# EAGLE design Shruti-FrontPanel-v02 (EAGLE 5.06)
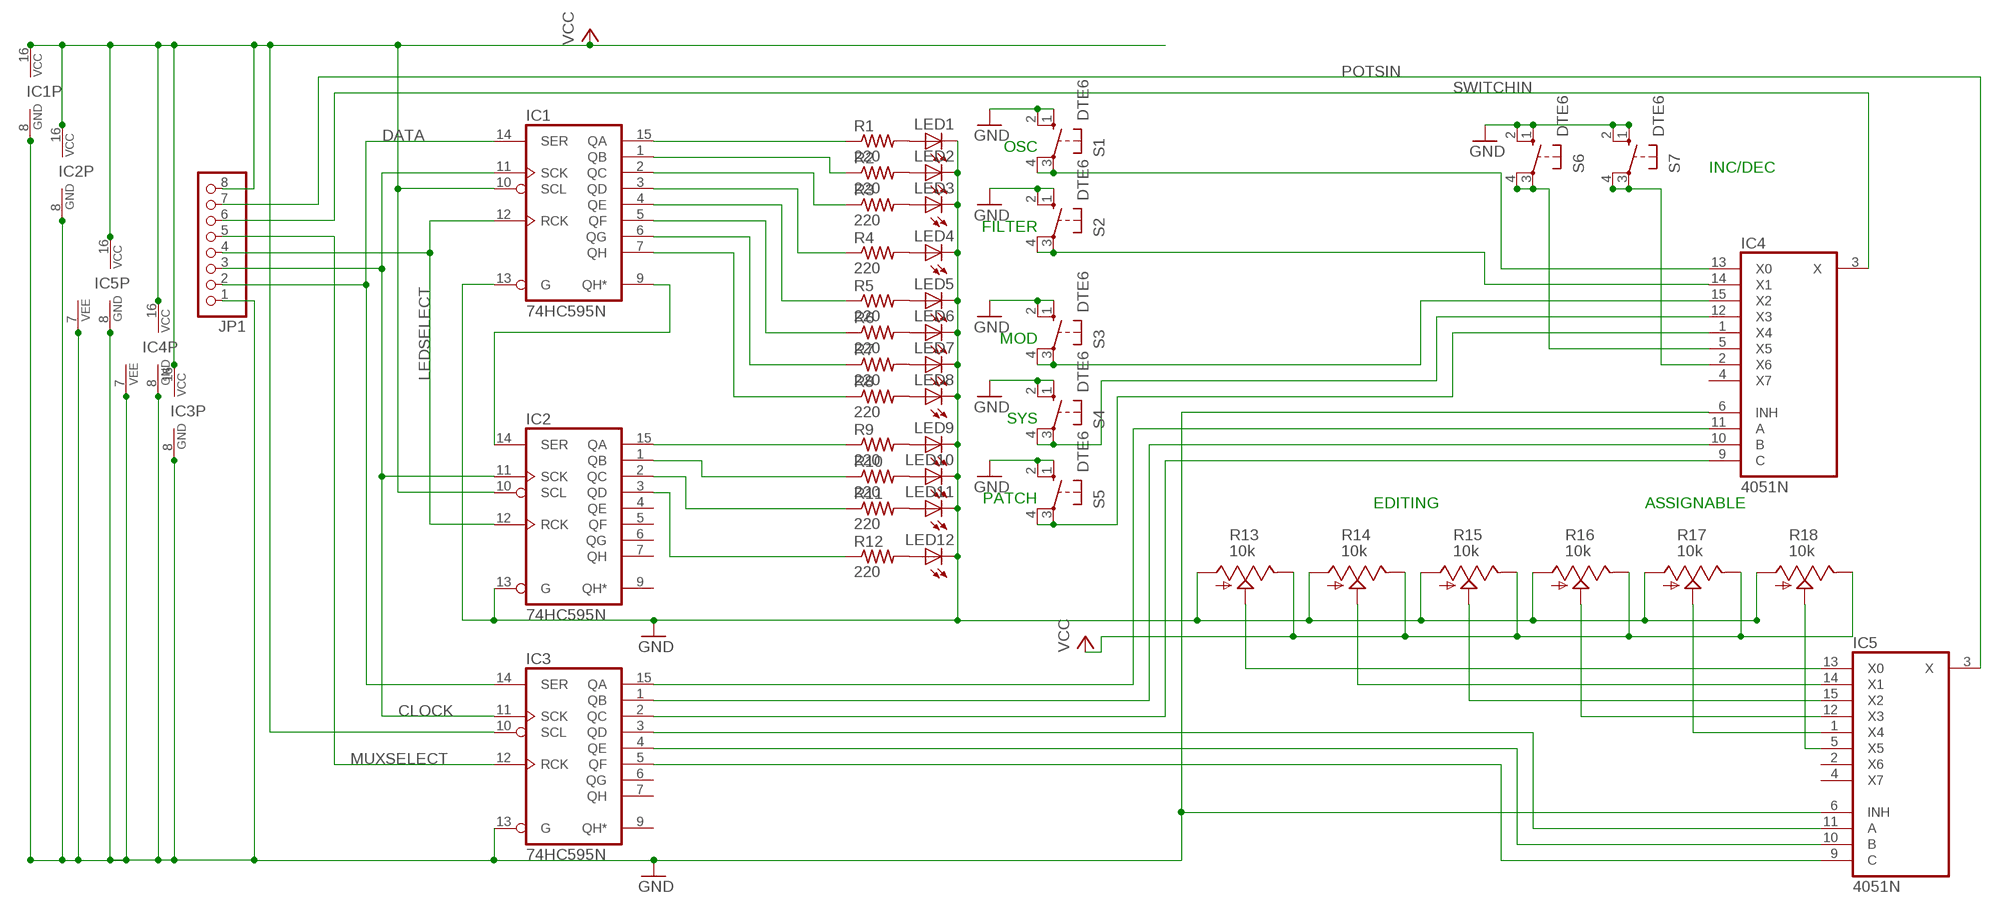
[diagram p0: schematic, sheet 1]

## Parts
IC1  74HC595N  [DIL16]
IC2  74HC595N  [DIL16]
IC3  74HC595N  [DIL16]
IC4  4051N  [DIL16]
IC5  4051N  [DIL16]
JP1  PINHD-1X8  [1X08]
LED1  LED3MM  [LED3MM]
LED2  LED3MM  [LED3MM]
LED3  LED3MM  [LED3MM]
LED4  LED3MM  [LED3MM]
LED5  LED3MM  [LED3MM]
LED6  LED3MM  [LED3MM]
LED7  LED3MM  [LED3MM]
LED8  LED3MM  [LED3MM]
LED9  LED3MM  [LED3MM]
LED10  LED3MM  [LED3MM]
LED11  LED3MM  [LED3MM]
LED12  LED3MM  [LED3MM]
R1  220  R-US_0207/7  [0207/7]
R2  220  R-US_0207/7  [0207/7]
R3  220  R-US_0207/7  [0207/7]
R4  220  R-US_0207/7  [0207/7]
R5  220  R-US_0207/7  [0207/7]
R6  220  R-US_0207/7  [0207/7]
R7  220  R-US_0207/7  [0207/7]
R8  220  R-US_0207/7  [0207/7]
R9  220  R-US_0207/7  [0207/7]
R10  220  R-US_0207/7  [0207/7]
R11  220  R-US_0207/7  [0207/7]
R12  220  R-US_0207/7  [0207/7]
R13  10k  POT_US  [ALPS_POT_SFE]
R14  10k  POT_US  [ALPS_POT_SFE]
R15  10k  POT_US  [ALPS_POT_SFE]
R16  10k  POT_US  [ALPS_POT_SFE]
R17  10k  POT_US  [ALPS_POT_SFE]
R18  10k  POT_US  [ALPS_POT_SFE]
S1  DTE6  40-XX  [B3F-40XX]
S2  DTE6  40-XX  [B3F-40XX]
S3  DTE6  40-XX  [B3F-40XX]
S4  DTE6  40-XX  [B3F-40XX]
S5  DTE6  40-XX  [B3F-40XX]
S6  DTE6  40-XX  [B3F-40XX]
S7  DTE6  40-XX  [B3F-40XX]

## Nets
CLOCK: IC1.11(SCK) IC2.11(SCK) IC3.11(SCK) JP1.3
DATA: IC1.14(SER) IC3.14(SER) JP1.2
GND: IC1.8(GND) IC1.13(G) IC2.8(GND) IC2.13(G) IC3.8(GND) IC3.13(G) IC4.6(INH) IC4.7(VEE) IC4.8(GND) IC5.6(INH) IC5.7(VEE) IC5.8(GND) JP1.1 LED1.K(C) LED2.K(C) LED3.K(C) LED4.K(C) LED5.K(C) LED6.K(C) LED7.K(C) LED8.K(C) LED9.K(C) LED10.K(C) LED11.K(C) LED12.K(C) R13.P$3(A) R14.P$3(A) R15.P$3(A) R16.P$3(A) R17.P$3(A) R18.P$3(A) S1.1(S) S1.2(S1) S2.1(S) S2.2(S1) S3.1(S) S3.2(S1) S4.1(S) S4.2(S1) S5.1(S) S5.2(S1) S6.1(S) S6.2(S1) S7.1(S) S7.2(S1)
LEDSELECT: IC1.12(RCK) IC2.12(RCK) JP1.4
MUXSELECT: IC3.12(RCK) JP1.5
N$1: IC1.9(QH*) IC2.14(SER)
N$2: LED1.A R1.2
N$3: LED2.A R2.2
N$4: LED3.A R3.2
N$5: LED4.A R4.2
N$6: LED5.A R5.2
N$7: LED6.A R6.2
N$8: LED7.A R7.2
N$9: LED9.A R9.2
N$10: LED10.A R10.2
N$11: LED11.A R11.2
N$12: LED12.A R12.2
N$13: IC1.15(QA) R1.1
N$14: IC1.1(QB) R2.1
N$15: IC1.2(QC) R3.1
N$16: IC1.3(QD) R4.1
N$17: IC1.4(QE) R5.1
N$18: IC1.5(QF) R6.1
N$19: IC1.6(QG) R7.1
N$20: IC1.7(QH) R8.1
N$21: LED8.A R8.2
N$22: IC2.15(QA) R9.1
N$23: IC2.1(QB) R10.1
N$24: IC2.2(QC) R11.1
N$25: IC3.15(QA) IC4.11(A)
N$26: IC3.1(QB) IC4.10(B)
N$27: IC2.3(QD) R12.1
N$28: IC5.1(X4) R17.P$2(S)
N$29: IC5.5(X5) R18.P$2(S)
N$31: IC3.2(QC) IC4.9(C)
N$32: IC3.3(QD) IC5.11(A)
N$33: IC3.4(QE) IC5.10(B)
N$34: IC3.5(QF) IC5.9(C)
N$35: IC5.13(X0) R13.P$2(S)
N$36: IC4.5(X5) S6.3(P) S6.4(P1)
N$37: IC5.14(X1) R14.P$2(S)
N$38: IC5.15(X2) R15.P$2(S)
N$39: IC5.12(X3) R16.P$2(S)
N$40: IC4.2(X6) S7.3(P) S7.4(P1)
N$41: IC4.13(X0) S1.3(P) S1.4(P1)
N$42: IC4.14(X1) S2.3(P) S2.4(P1)
N$43: IC4.15(X2) S3.3(P) S3.4(P1)
N$44: IC4.12(X3) S4.3(P) S4.4(P1)
N$45: IC4.1(X4) S5.3(P) S5.4(P1)
POTSIN: IC5.3(X) JP1.7
SWITCHIN: IC4.3(X) JP1.6
VCC: IC1.10(SCL) IC1.16(VCC) IC2.10(SCL) IC2.16(VCC) IC3.10(SCL) IC3.16(VCC) IC4.16(VCC) IC5.16(VCC) JP1.8 R13.P$1(E) R14.P$1(E) R15.P$1(E) R16.P$1(E) R17.P$1(E) R18.P$1(E)
Unconnected: IC2.4(QE) IC2.5(QF) IC2.6(QG) IC2.7(QH) IC2.9(QH*) IC3.6(QG) IC3.7(QH) IC3.9(QH*) IC4.4(X7) IC5.2(X6) IC5.4(X7)

## Notes on the sheet
- OSC
- INC/DEC
- FILTER
- MOD
- SYS
- PATCH
- EDITING | ASSIGNABLE

## Library data of the parts
IC1-IC3 = 74xx-eu:74*595: 8-bit SHIFT REGISTER, output latch
IC4 IC5 = 40xx:4051: 8-channel ANALOG MULTIPLEXER
JP1 = pinhead:PINHD-1X8: PIN HEADER
LED1-LED12 = led:LED: LED OSRAM: - CHIPLED LG R971, LG N971, LY N971, LG Q971, LY Q971, LO R971, LY R971 LH N974, LH R974 LS Q976, LO Q976, LY Q976 LO Q996 - Hyper CHIPLED LW Q18S LB Q993, LB Q99A, LB R99A - SideLED LS A670, LO A670, LY A670, LG A670, LP A670 LB A673, LV A673, LT A673, LW A673 LH A674 LY A675 LS A676, LA A676, LO A676, LY A676, LW A676 LS A679, LY A679, LG A679 - Hyper Micro SIDELED® LS Y876, LA Y876, LO Y876, LY Y876 LT Y87S - SmartLED LW L88C, LW L88S LB L89C, LB L89S, LG L890 LS L89K, LO L89K, LY L89K LS L896, LA L896, LO L896, LY L896 - TOPLED LS T670, LO T670, LY T670, LG T670, LP T670 LSG T670, LSP T670, LSY T670, LOP T670, LYG T670 LG T671, LOG T671, LSG T671 LB T673, LV T673, LT T673, LW T673 LH T674 LS T676, LA T676, LO T676, LY T676, LB T676, LH T676, LSB T676, LW T676 LB T67C, LV T67C, LT T67C, LS T67K, LO T67K, LY T67K, LW E67C LS E67B, LA E67B, LO E67B, LY E67B, LB E67C, LV E67C, LT E67C LW T67C LS T679, LY T679, LG T679 LS T770, LO T770, LY T770, LG T770, LP T770 LB T773, LV T773, LT T773, LW T773 LH T774 LS E675, LA E675, LY E675, LS T675 LS T776, LA T776, LO T776, LY T776, LB T776 LHGB T686 LT T68C, LB T68C - Hyper Mini TOPLED® LB M676 - Mini TOPLED Santana® LG M470 LS M47K, LO M47K, LY M47K Source: http://www.osram.convergy.de LUXEON: - LUMILED® LXK2-PW12-R00, LXK2-PW12-S00, LXK2-PW14-U00, LXK2-PW14-V00 LXK2-PM12-R00, LXK2-PM12-S00, LXK2-PM14-U00 LXK2-PE12-Q00, LXK2-PE12-R00, LXK2-PE12-S00, LXK2-PE14-T00, LXK2-PE14-U00 LXK2-PB12-K00, LXK2-PB12-L00, LXK2-PB12-M00, LXK2-PB14-N00, LXK2-PB14-P00, LXK2-PB14-Q00 LXK2-PR12-L00, LXK2-PR12-M00, LXK2-PR14-Q00, LXK2-PR14-R00 LXK2-PD12-Q00, LXK2-PD12-R00, LXK2-PD12-S00 LXK2-PH12-R00, LXK2-PH12-S00 LXK2-PL12-P00, LXK2-PL12-Q00, LXK2-PL12-R00 Source: www.luxeon.com KINGBRIGHT: KA-3528ASYC Source: www.kingbright.com
R1-R12 = resistor:R-US_: RESISTOR, American symbol
R13-R18 = pot-alps:POT_US
S1-S7 = switch-omron:40-XX: OMRON SWITCH

## Board
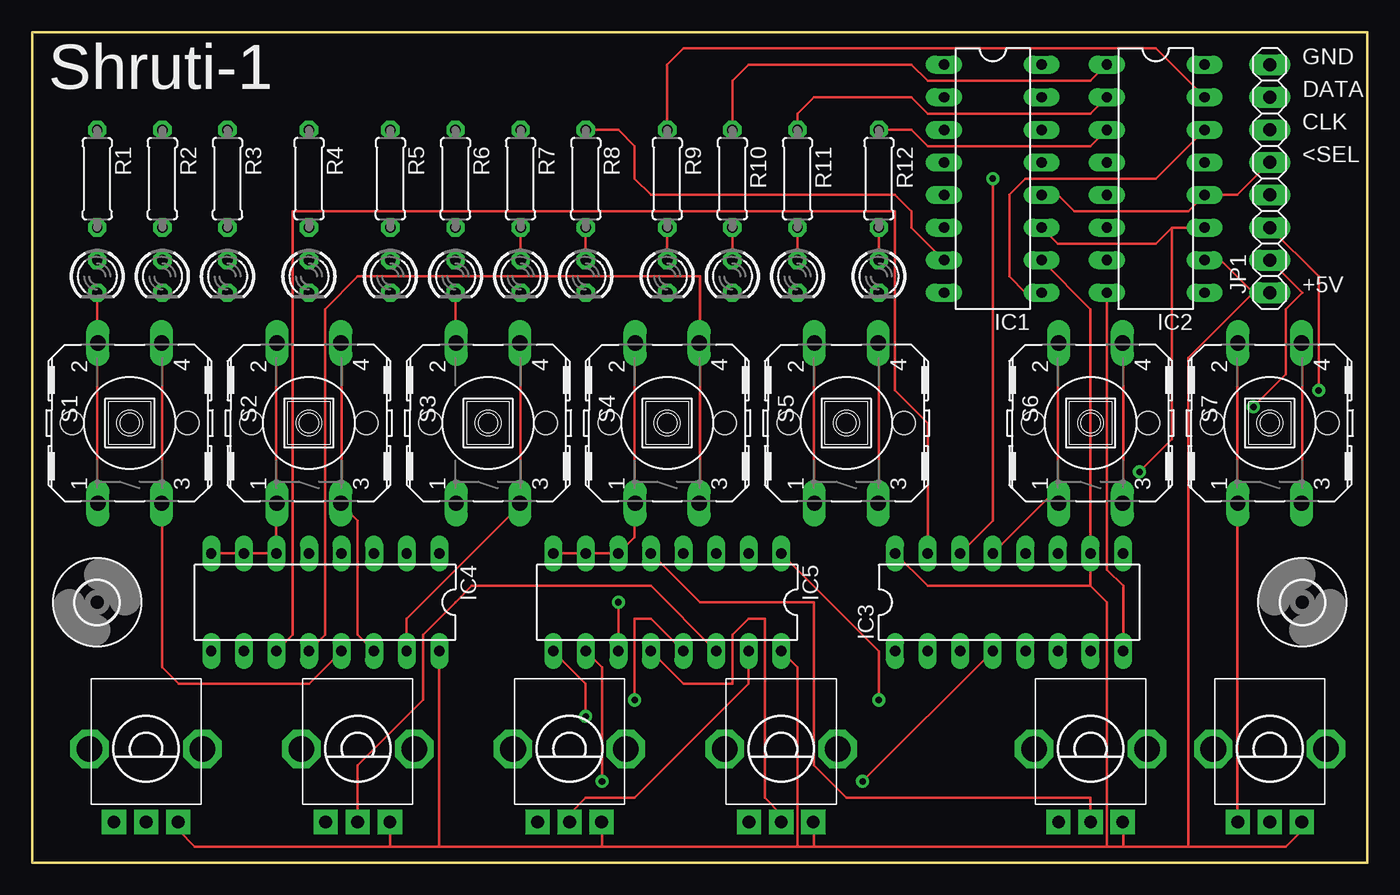
[diagram p1: board, top side]
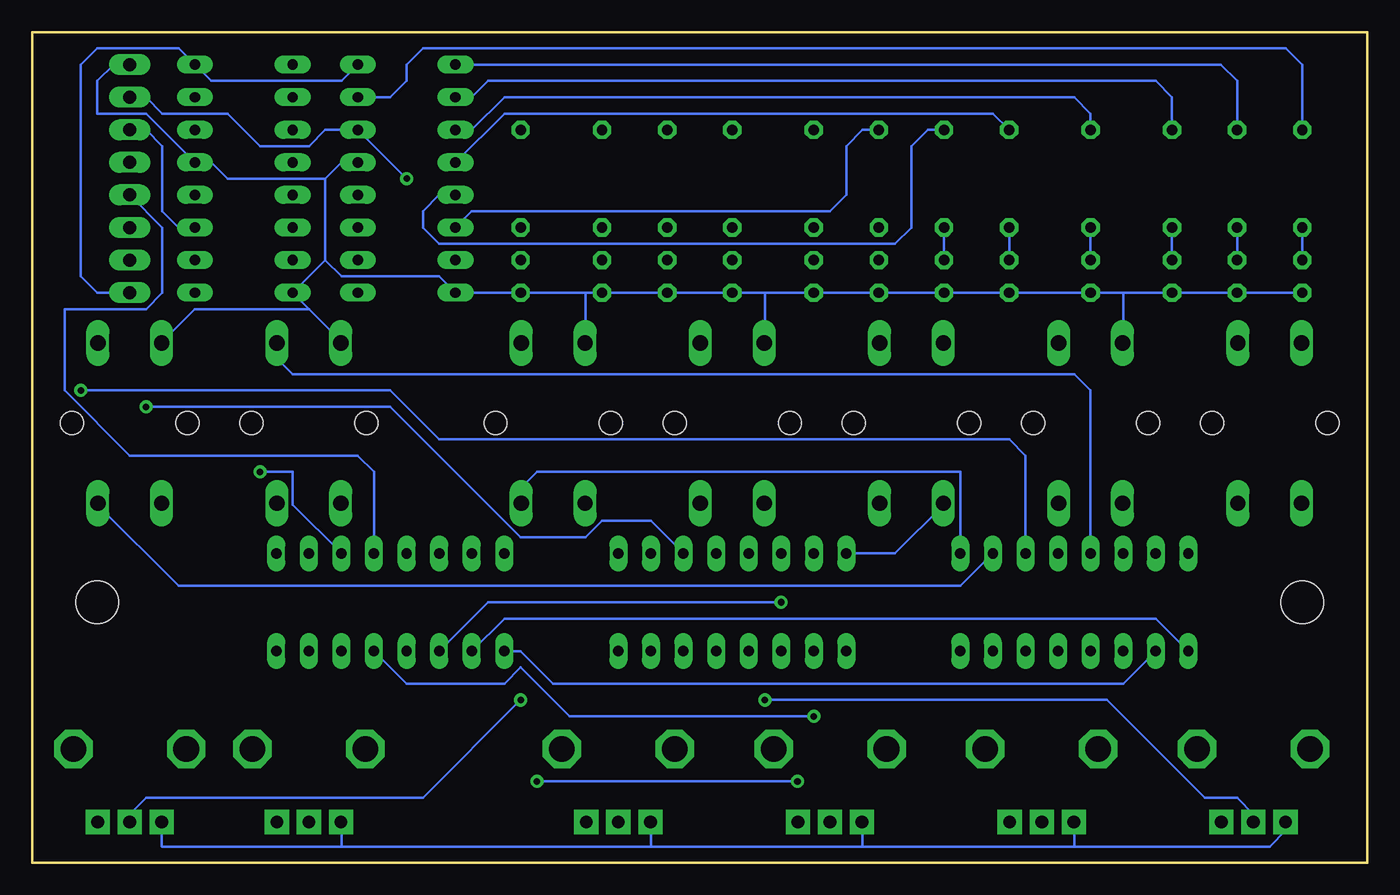
[diagram p2: board, bottom side, seen from below]

Size 104.14 x 64.77 mm. Coordinates in mm from the lower left corner, seen from the top.
Outline: 0,64.76 104.14,64.76 104.14,0 0,0 0,64.77
Copper layers (1*16): Top 0.035mm / dielectric 1.5mm / Bottom 0.035mm
Design rules "SparkFun": minimum track width 8mil, minimum drill 20mil, track to track 8mil, track to pad 8mil, pad to pad 8mil, via to via 8mil, smd to smd 8mil, copper to edge 10mil, drill to drill 8mil, minimum pad ring 12mil, minimum via ring 10mil, stop-mask expansion 4mil, vias tented up to drill 25mil, thermal gap 10mil

### Footprints (pad centres in the part's own frame; a part is rotated, then mirrored left to right if it is on the bottom)
DIL16 = drill 0.813 long: 1 -8.89,-3.81; 2 -6.35,-3.81; 3 -3.81,-3.81; 4 -1.27,-3.81; 5 1.27,-3.81; 6 3.81,-3.81; 7 6.35,-3.81; 8 8.89,-3.81; 9 8.89,3.81; 10 6.35,3.81; 11 3.81,3.81; 12 1.27,3.81; 13 -1.27,3.81; 14 -3.81,3.81; 15 -6.35,3.81; 16 -8.89,3.81
1X08 = drill 1.016 long: 1 -8.89,0; 2 -6.35,0; 3 -3.81,0; 4 -1.27,0; 5 1.27,0; 6 3.81,0; 7 6.35,0; 8 8.89,0
LED3MM = drill 0.813 octagon: A -1.27,0; K 1.27,0
0207/7 = drill 0.813 octagon: 1 -3.81,0; 2 3.81,0
ALPS_POT_SFE = drill 1 pad 1.88 square: P$1 -2.5,5.7; P$2 0,5.7; P$3 2.5,5.7 | drill 2 octagon: P$4 -4.4,0; P$5 4.4,0
B3F-40XX = drill 1.194 long: 1 -6.248,2.489; 2 6.248,2.489; 3 -6.248,-2.489; 4 6.248,-2.489 | hole 1.803: 0,-4.496; 0,4.496
3,3 = hole 3.3: 0,0

### Placement (x,y rotation side)
IC1  74.93,53.34 270 top
IC2  87.63,53.34 270 top
IC3  76.2,20.32 0 top
IC4  22.86,20.32 180 top
IC5  49.53,20.32 180 top
JP1  96.52,53.34 270 top
LED1  5.08,45.72 270 top
LED2  10.16,45.72 270 top
LED3  15.24,45.72 270 top
LED4  21.59,45.72 270 top
LED5  27.94,45.72 270 top
LED6  33.02,45.72 270 top
LED7  38.1,45.72 270 top
LED8  43.18,45.72 270 top
LED9  49.53,45.72 270 top
LED10  54.61,45.72 270 top
LED11  59.69,45.72 270 top
LED12  66.04,45.72 270 top
R1  5.08,53.34 270 top
R2  10.16,53.34 270 top
R3  15.24,53.34 270 top
R4  21.59,53.34 270 top
R5  27.94,53.34 270 top
R6  33.02,53.34 270 top
R7  38.1,53.34 270 top
R8  43.18,53.34 270 top
R9  49.53,53.34 270 top
R10  54.61,53.34 270 top
R11  59.69,53.34 270 top
R12  66.04,53.34 270 top
R13  8.89,8.89 180 top
R14  25.4,8.89 180 top
R15  41.91,8.89 180 top
R16  58.42,8.89 180 top
R17  96.52,8.89 180 top
R18  82.55,8.89 180 top
S1  7.62,34.29 90 top
S2  21.59,34.29 90 top
S3  35.56,34.29 90 top
S4  49.53,34.29 90 top
S5  63.5,34.29 90 top
S6  82.55,34.29 90 top
S7  96.52,34.29 90 top
U$1  [3,3]  5.08,20.32 0 top
U$2  [3,3]  99.06,20.32 90 top

### Tracks (layer width: path | path; a pad name or v marks a point on that pad's centre or on a via)
CLOCK  (via drill 0.51)
  Top 0.203: 88.9,49.53 IC2.11 | 88.9,49.53 87.63,48.26 80.01,48.26 IC1.11 | v86.36,30.48 88.9,33.02 88.9,49.53
  Bottom 0.203: JP1.3 95.25,57.15 93.98,55.88 93.98,50.8 92.71,49.53 IC2.11 | IC3.11 83.82,27.94 83.82,30.48 v86.36,30.48
DATA  (via drill 0.51)
  Top 0.203: IC3.14 74.93,26.67 v74.93,53.34
  Bottom 0.203: JP1.2 95.25,59.69 93.98,58.42 88.9,58.42 86.36,55.88 82.55,55.88 81.28,57.15 IC1.14 v74.93,53.34
GND
  Top 0.203: S7.2 93.98,39.37 93.98,29.21 S7.1 93.98,27.94 93.98,3.81 R17.P$3 | S5.1 60.96,29.21 60.96,39.37 S5.2 | S3.1 33.02,29.21 | 33.02,39.37 S3.2 33.02,40.64 LED6.K | S1.1 5.08,29.21 5.08,39.37 S1.2 5.08,40.64 LED1.K | 80.01,29.21 80.01,39.37 S6.2 | S4.2 46.99,39.37 46.99,29.21 S4.1 46.99,27.94 46.99,25.4 IC5.6 IC5.7 IC5.8 | S2.2 19.05,39.37 19.05,29.21 S2.1 19.05,27.94 IC4.6 IC4.7 IC4.8 | 80.01,29.21 IC3.13 | 80.01,29.21 S6.1 | IC3.8 85.09,21.59 83.82,22.86 IC2.8
  Bottom 0.203: LED6.K LED5.K LED4.K 19.05,44.45 | LED6.K 33.07,44.4 | LED6.K LED7.K LED8.K 46.99,44.45 | 5.13,44.4 LED1.K LED2.K LED3.K 19.05,44.45 | 81.28,46.99 IC2.8 82.55,43.18 | 81.28,46.99 81.28,53.34 | 81.28,53.34 80.01,54.61 IC1.13 | 81.28,53.34 88.9,53.34 90.17,54.61 IC2.13 95.25,58.42 99.06,58.42 99.06,60.96 97.79,62.23 JP1.1 | 46.99,44.45 LED9.K LED10.K LED11.K 60.96,44.45 | 60.96,44.45 LED12.K IC1.8 72.39,45.72 80.01,45.72 81.28,46.99 | 19.05,44.45 19.1,44.45 | 46.99,44.45 47.04,44.45 | 60.96,44.45 61.01,44.45 | 19.05,44.45 19.05,40.64 S2.2 | 46.99,44.45 46.99,40.64 S4.2 | 60.96,44.45 60.96,40.64 S5.2 | S7.1 93.98,27.94 | S6.1 80.01,27.94 | R13.P$3 6.35,3.15 6.35,2.54 7.62,1.27 22.86,1.27 | 22.86,1.27 39.37,1.27 | 39.37,1.27 55.88,1.27 | 55.88,1.27 80.01,1.27 | 80.01,1.27 93.98,1.27 94.02,1.31 R17.P$3 | R18.P$3 80.01,3.15 80.01,1.27 | R16.P$3 55.88,3.15 55.88,1.27 | R15.P$3 39.37,3.15 39.37,1.27 | R14.P$3 22.86,3.15 22.86,1.27 | IC5.8 36.83,24.13 33.02,27.94 S3.1 | 82.55,43.18 80.01,40.64 S6.2 | 82.55,43.18 91.44,43.18 93.98,40.64 S7.2
LEDSELECT
  Top 0.203: IC1.12 80.01,52.07 81.28,50.8 90.17,50.8 IC2.12 93.98,52.07 JP1.4
MUXSELECT
  Bottom 0.203: IC3.12 77.47,30.48 78.74,31.75 96.52,31.75 101.6,36.83 101.6,43.18 95.25,43.18 93.98,44.45 93.98,49.53 JP1.5
N$1
  Top 0.203: IC1.9 77.47,44.45 76.2,45.72 76.2,52.07 77.47,53.34 87.63,53.34 IC2.14
N$2
  Bottom 0.203: LED1.A R1.2
N$3
  Bottom 0.203: LED2.A R2.2
N$4
  Bottom 0.203: LED3.A R3.2
N$5
  Bottom 0.203: LED4.A R4.2
N$6
  Bottom 0.203: LED5.A R5.2
N$7
  Bottom 0.203: LED6.A R6.2
N$8
  Top 0.203: LED7.A R7.2
N$9
  Top 0.203: LED9.A R9.2
N$10
  Top 0.203: LED10.A R10.2
N$11
  Top 0.203: LED11.A R11.2
N$12
  Top 0.203: LED12.A R12.2
N$13
  Bottom 0.203: R1.1 5.08,62.23 6.35,63.5 73.66,63.5 74.93,62.23 74.93,60.96 76.2,59.69 IC1.15
N$14
  Bottom 0.203: R2.1 10.16,60.96 11.43,62.23 IC1.1
N$15
  Bottom 0.203: R3.1 15.24,59.69 16.51,60.96 68.58,60.96 69.85,59.69 IC1.2
N$16
  Bottom 0.203: R4.1 21.59,58.42 22.86,59.69 67.31,59.69 69.85,57.15 IC1.3
N$17
  Bottom 0.203: R5.1 29.21,58.42 67.31,58.42 IC1.4
N$18
  Bottom 0.203: R6.1 34.29,57.15 35.56,55.88 35.56,49.53 36.83,48.26 72.39,48.26 73.66,49.53 73.66,50.8 72.39,52.07 IC1.5
N$19
  Bottom 0.203: R7.1 39.37,57.15 40.64,55.88 40.64,52.07 41.91,50.8 69.85,50.8 IC1.6
N$20
  Top 0.203: R8.1 45.72,57.15 46.99,55.88 46.99,53.34 48.26,52.07 67.31,52.07 68.58,50.8 68.58,49.53 IC1.7
N$21
  Top 0.203: LED8.A R8.2
N$22
  Top 0.203: R9.1 49.53,62.23 50.8,63.5 87.63,63.5 IC2.15
N$23
  Top 0.203: R10.1 54.61,60.96 55.88,62.23 68.58,62.23 69.85,60.96 82.55,60.96 IC2.1
N$24
  Top 0.203: R11.1 59.69,58.42 60.96,59.69 68.58,59.69 69.85,58.42 82.55,58.42 IC2.2
N$25
  Top 0.203: IC4.11 20.32,17.78 20.32,50.8 67.31,50.8 67.31,36.83 69.85,34.29 IC3.15
N$26
  Bottom 0.203: IC4.10 19.05,13.97 63.5,13.97 66.04,16.51 IC3.1
N$27
  Top 0.203: R12.1 68.58,57.15 69.85,55.88 82.55,55.88 IC2.3
N$28  (via drill 0.51)
  Top 0.203: IC5.1 66.04,16.51 v66.04,12.7
  Bottom 0.203: v66.04,12.7 73.66,5.08 95.25,5.08 96.52,3.81 R17.P$2
N$29
  Top 0.203: IC5.5 52.07,20.32 60.96,20.32 60.96,7.62 63.5,5.08 82.55,5.08 R18.P$2
N$31
  Bottom 0.203: IC4.9 16.51,19.05 67.31,19.05 IC3.2
N$32  (via drill 0.51)
  Top 0.203: IC5.11 v45.72,20.32
  Bottom 0.203: v45.72,20.32 68.58,20.32 IC3.3
N$33  (via drill 0.51)
  Top 0.203: IC5.10 44.45,15.24 v44.45,6.35 | v64.77,6.35 IC3.4
  Bottom 0.203: v44.45,6.35 v64.77,6.35
N$34  (via drill 0.51)
  Top 0.203: IC5.9 43.18,13.97 v43.18,11.43
  Bottom 0.203: v43.18,11.43 62.23,11.43 66.04,15.24 67.31,13.97 74.93,13.97 IC3.5
N$35  (via drill 0.51)
  Top 0.203: IC5.13 48.26,19.05 46.99,19.05 v46.99,12.7
  Bottom 0.203: v46.99,12.7 20.32,12.7 12.7,5.08 10.16,5.08 8.89,3.81 R13.P$2
N$36
  Top 0.203: S6.3 85.09,29.21 85.09,39.37 S6.4
  Bottom 0.203: IC4.5 21.59,36.83 22.86,38.1 83.82,38.1 85.09,39.37 S6.4
N$37
  Top 0.203: IC5.14 48.26,21.59 34.29,21.59 33.02,20.32 30.48,17.78 30.48,12.7 25.4,7.62 R14.P$2
N$38
  Top 0.203: IC5.15 55.88,13.97 46.99,5.08 43.18,5.08 41.91,3.81 R15.P$2
N$39
  Top 0.203: IC5.12 50.8,13.97 54.61,13.97 54.61,17.78 55.88,19.05 57.15,19.05 57.15,5.08 58.42,3.81 R16.P$2
N$40
  Top 0.203: S7.4 99.06,39.37 99.06,29.21 S7.3
  Bottom 0.203: IC4.2 31.75,21.59 92.71,21.59 99.06,27.94 S7.3
N$41
  Top 0.203: S1.4 10.16,39.37 10.16,29.21 S1.3 10.16,27.94 10.16,15.24 11.43,13.97 21.59,13.97 IC4.13
N$42
  Top 0.203: S2.4 24.13,39.37 24.13,29.21 S2.3 24.13,27.94 25.4,26.67 25.4,17.78 IC4.14
N$43
  Top 0.203: S3.4 38.1,39.37 38.1,29.21 S3.3 38.1,27.94 29.21,19.05 IC4.15
N$44
  Top 0.203: S4.3 52.07,29.21 52.07,39.37 S4.4 52.07,40.64 52.07,45.72 25.4,45.72 22.86,43.18 22.86,17.78 IC4.12
N$45
  Top 0.203: S5.4 66.04,39.37 66.04,29.21 S5.3
  Bottom 0.203: 66.04,27.94 S5.3 66.04,29.21 64.77,30.48 31.75,30.48 IC4.1
POTSIN  (via drill 0.51)
  Top 0.203: v95.25,35.56 97.79,38.1 97.79,43.18 99.06,44.45 JP1.7
  Bottom 0.203: IC5.3 55.88,26.67 59.69,26.67 60.96,25.4 66.04,25.4 76.2,35.56 v95.25,35.56
SWITCHIN  (via drill 0.51)
  Top 0.203: v100.33,36.83 100.33,45.72 JP1.6
  Bottom 0.203: IC4.3 26.67,31.75 27.94,33.02 72.39,33.02 76.2,36.83 v100.33,36.83
VCC
  Top 0.203: 95.25,44.45 92.71,46.99 IC2.10 | R13.P$1 11.43,3.15 11.43,2.54 12.7,1.27 27.94,1.27 | 27.94,1.27 31.75,1.27 | 31.75,1.27 44.45,1.27 | 44.45,1.27 59.69,1.27 | 59.69,1.27 60.96,1.27 | 60.96,1.27 83.82,1.27 | 83.82,1.27 85.09,1.27 | 85.09,1.27 90.17,1.27 | 90.17,1.27 97.79,1.27 99.06,2.54 R17.P$1 | R18.P$1 85.09,3.15 85.09,1.27 | R16.P$1 60.96,3.15 60.96,1.27 | R15.P$1 44.45,3.15 44.45,1.27 | R14.P$1 27.94,3.15 27.94,1.27 | IC3.16 69.85,21.59 82.55,21.59 | 82.55,21.59 IC3.10 82.55,43.18 IC1.10 | 31.75,1.27 IC4.16 | IC5.16 59.69,15.24 59.69,1.27 | 95.25,44.45 90.17,39.37 90.17,1.27 | 95.25,44.45 JP1.8 | 82.55,21.59 83.82,20.32 83.82,1.27
  Bottom 0.203: IC1.16 80.01,60.96 90.17,60.96 IC2.16 92.71,63.5 99.06,63.5 100.33,62.23 100.33,45.72 99.06,44.45 JP1.8

### Text on the board
tPlace: GND | Shruti-1 | DATA | CLK | <SEL | +5V
License: cc-by-nc-sa 3.0 | ol.gillet@gmail.com